# Altium schematic sheet DSPCONN.4-7.SCHDOC: Backplane
size B; Engineer: Eric Jonas; Organization: Wilson Lab; Address1: Picower Institute, MIT; Address2: 43 Vassar St. 46-5227; Address3: Cambridge, MA 02139; Address4: Australia 2086
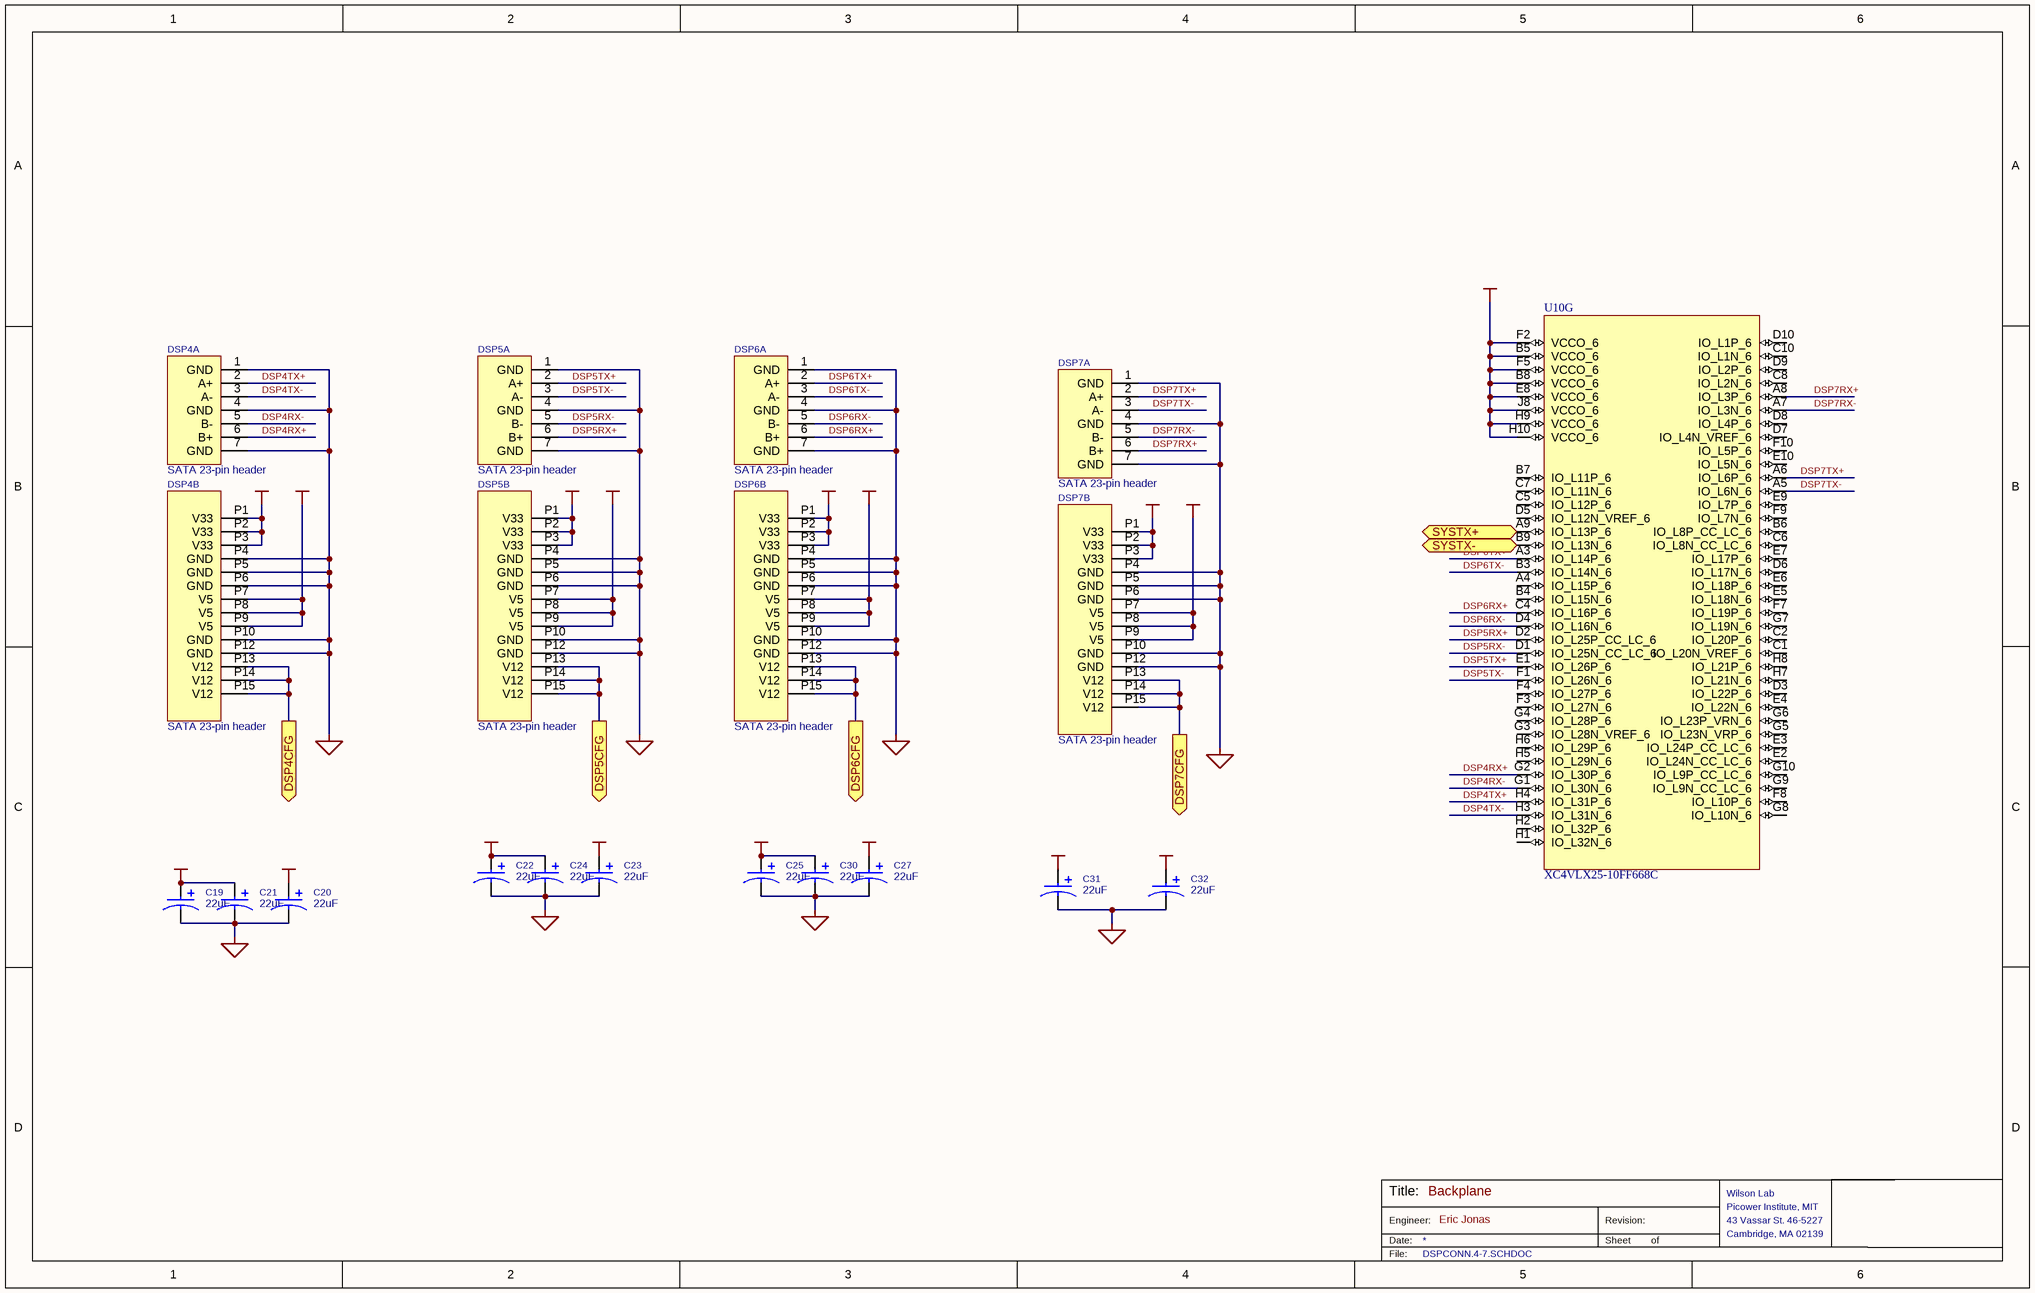
[diagram p0: DSPCONN.4-7.SCHDOC]

## Parts
C19  value 22uF  [6032]  (hidden comment: POLCAP2)
C20  value 22uF  [6032]  (hidden comment: POLCAP2)
C21  value 22uF  [6032]  (hidden comment: POLCAP2)
C22  value 22uF  [6032]  (hidden comment: POLCAP2)
C23  value 22uF  [6032]  (hidden comment: POLCAP2)
C24  value 22uF  [6032]  (hidden comment: POLCAP2)
C25  value 22uF  [6032]  (hidden comment: POLCAP2)
C27  value 22uF  [6032]  (hidden comment: POLCAP2)
C30  value 22uF  [6032]  (hidden comment: POLCAP2)
C31  value 22uF  [6032]  (hidden comment: POLCAP2)
C32  value 22uF  [6032]  (hidden comment: POLCAP2)
DSP4  SATA 23-pin header  [MOLEX 87713-1001]  (parts A,B of 2)
DSP5  SATA 23-pin header  [MOLEX 87713-1001]  (parts A,B of 2)
DSP6  SATA 23-pin header  [MOLEX 87713-1001]  (parts A,B of 2)
DSP7  SATA 23-pin header  [MOLEX 87713-1001]  (parts A,B of 2)
U10  XC4VLX25-10FF668C  [Xilinx FF668]  (part G of 13)

## Ports
DSP4CFG (out), DSP5CFG (out), DSP6CFG (out), DSP7CFG (out), SYSTX+ (in), SYSTX- (in)

## Nets
+2.5VCC: U10.B5(VCCO_6) U10.B8(VCCO_6) U10.E8(VCCO_6) U10.F2(VCCO_6) U10.F5(VCCO_6) U10.H9(VCCO_6) U10.H10(VCCO_6) U10.J8(VCCO_6)
+5VCC: C20.1 C23.1 C27.1 C32.1 DSP4.P7(V5) DSP4.P8(V5) DSP4.P9(V5) DSP5.P7(V5) DSP5.P8(V5) DSP5.P9(V5) DSP6.P7(V5) DSP6.P8(V5) DSP6.P9(V5) DSP7.P7(V5) DSP7.P8(V5) DSP7.P9(V5)
GND: C19.2 C20.2 C21.2 C22.2 C23.2 C24.2 C25.2 C27.2 C30.2 C31.2 C32.2 DSP4.1(GND) DSP4.4(GND) DSP4.7(GND) DSP4.P4(GND) DSP4.P5(GND) DSP4.P6(GND) DSP4.P10(GND) DSP4.P12(GND) DSP5.1(GND) DSP5.4(GND) DSP5.7(GND) DSP5.P4(GND) DSP5.P5(GND) DSP5.P6(GND) DSP5.P10(GND) DSP5.P12(GND) DSP6.1(GND) DSP6.4(GND) DSP6.7(GND) DSP6.P4(GND) DSP6.P5(GND) DSP6.P6(GND) DSP6.P10(GND) DSP6.P12(GND) DSP7.1(GND) DSP7.4(GND) DSP7.7(GND) DSP7.P4(GND) DSP7.P5(GND) DSP7.P6(GND) DSP7.P10(GND) DSP7.P12(GND)
VCC: C19.1 C21.1 C22.1 C24.1 C25.1 C30.1 C31.1 DSP4.P1(V33) DSP4.P2(V33) DSP4.P3(V33) DSP5.P1(V33) DSP5.P2(V33) DSP5.P3(V33) DSP6.P1(V33) DSP6.P2(V33) DSP6.P3(V33) DSP7.P1(V33) DSP7.P2(V33) DSP7.P3(V33)
DSP4CFG: DSP4.P13(V12) DSP4.P14(V12) DSP4.P15(V12) ; port DSP4CFG
DSP4RX+: DSP4.6(B+) U10.G2(IO_L30P_6)
DSP4RX-: DSP4.5(B-) U10.G1(IO_L30N_6)
DSP4TX+: DSP4.2(A+) U10.H4(IO_L31P_6)
DSP4TX-: DSP4.3(A-) U10.H3(IO_L31N_6)
DSP5CFG: DSP5.P13(V12) DSP5.P14(V12) DSP5.P15(V12) ; port DSP5CFG
DSP5RX+: DSP5.6(B+) U10.D2(IO_L25P_CC_LC_6)
DSP5RX-: DSP5.5(B-) U10.D1(IO_L25N_CC_LC_6)
DSP5TX+: DSP5.2(A+) U10.E1(IO_L26P_6)
DSP5TX-: DSP5.3(A-) U10.F1(IO_L26N_6)
DSP6CFG: DSP6.P13(V12) DSP6.P14(V12) DSP6.P15(V12) ; port DSP6CFG
DSP6RX+: DSP6.6(B+) U10.C4(IO_L16P_6)
DSP6RX-: DSP6.5(B-) U10.D4(IO_L16N_6)
DSP6TX+: DSP6.2(A+) U10.A3(IO_L14P_6)
DSP6TX-: DSP6.3(A-) U10.B3(IO_L14N_6)
DSP7CFG: DSP7.P13(V12) DSP7.P14(V12) DSP7.P15(V12) ; port DSP7CFG
DSP7RX+: DSP7.6(B+) U10.A8(IO_L3P_6)
DSP7RX-: DSP7.5(B-) U10.A7(IO_L3N_6)
DSP7TX+: DSP7.2(A+) U10.A6(IO_L6P_6)
DSP7TX-: DSP7.3(A-) U10.A5(IO_L6N_6)
SYSTX+: U10.A9(IO_L13P_6) ; port SYSTX+
SYSTX-: U10.B9(IO_L13N_6) ; port SYSTX-

Not connected (* = marked no-connect by the designer): U10 A4(IO_L15P_6) B4(IO_L15N_6) B6(IO_L8P_CC_LC_6) B7(IO_L11P_6) C1(IO_L20N_VREF_6) C2(IO_L20P_6) C5(IO_L12P_6) C6(IO_L8N_CC_LC_6) C7(IO_L11N_6) C8(IO_L2N_6) C10(IO_L1N_6) D3(IO_L22P_6) D5(IO_L12N_VREF_6) D6(IO_L17N_6) D7(IO_L4N_VREF_6) D8(IO_L4P_6) D9(IO_L2P_6) D10(IO_L1P_6) E2(IO_L24N_CC_LC_6) E3(IO_L24P_CC_LC_6) E4(IO_L22N_6) E5(IO_L18N_6) E6(IO_L18P_6) E7(IO_L17P_6) E9(IO_L7P_6) E10(IO_L5N_6) F3(IO_L27N_6) F4(IO_L27P_6) F7(IO_L19P_6) F8(IO_L10P_6) F9(IO_L7N_6) F10(IO_L5P_6) G3(IO_L28N_VREF_6) G4(IO_L28P_6) G5(IO_L23N_VRP_6) G6(IO_L23P_VRN_6) G7(IO_L19N_6) G8(IO_L10N_6) G9(IO_L9N_CC_LC_6) G10(IO_L9P_CC_LC_6) H1(IO_L32N_6) H2(IO_L32P_6) H5(IO_L29N_6) H6(IO_L29P_6) H7(IO_L21N_6) H8(IO_L21P_6)

## Notes on the sheet
- Title:
- Engineer:
- Date:
- Revision:
- Sheet
- of
- File:

## Library data of the parts
C19-C25 C27 C30-C32 = POLCAP2: Standard Capacitor
DSP4-DSP7 = SATA-23
U10 = XC4VLX25-10FF668C: Xilinx Virtex-4